# Altium schematic sheet lvds.SchDoc
size Legal
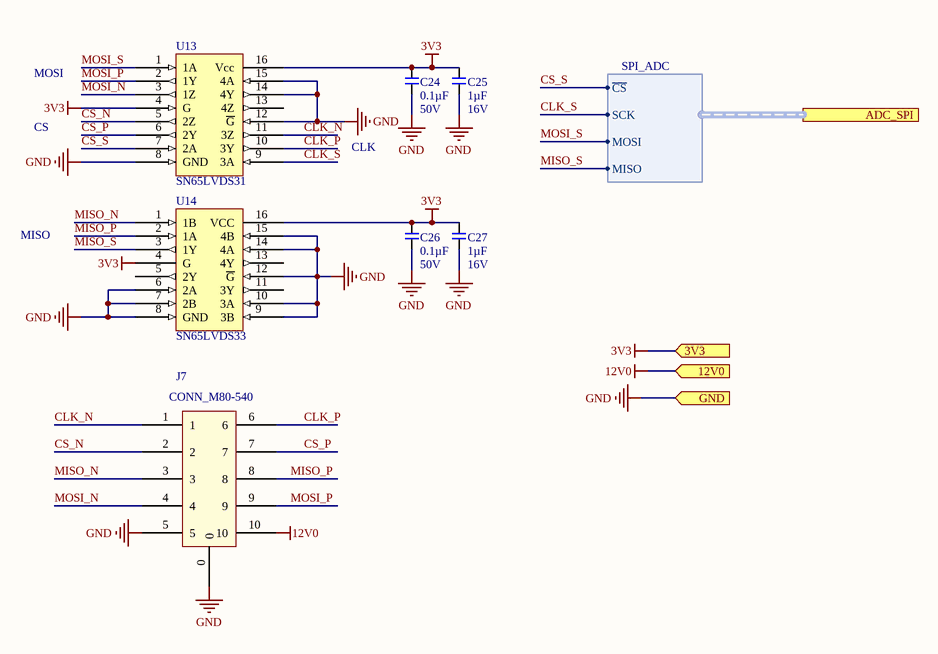
[diagram p0: lvds.SchDoc]

## Parts
C24  Capacitance (shorthand): 0.1µF  Rated Voltage: 50V  [C0603P]  (hidden comment: __template_cap)
C25  Capacitance (shorthand): 1µF  Rated Voltage: 16V  [C0603P]  (hidden comment: __template_cap)
C26  Capacitance (shorthand): 0.1µF  Rated Voltage: 50V  [C0603P]  (hidden comment: __template_cap)
C27  Capacitance (shorthand): 1µF  Rated Voltage: 16V  [C0603P]  (hidden comment: __template_cap)
J7  CONN_M80-540  [HARWIN-M80-5401042]
U13  SN65LVDS31  [16SOIC150]
U14  SN65LVDS33  [16SOIC150]

## Ports
3V3 (in), 12V0 (in), ADC_SPI (harness SPI_ADC), GND (in)

## Harnesses
SPI_ADC: SCK, MOSI, MISO, ~{CS}

## Nets
3V3: C24.1 C25.1 C26.1 C27.1 U13.4(G) U13.16(Vcc) U14.4(G) U14.16(VCC) ; port 3V3
12V0: J7.10 ; port 12V0
GND: C24.2 C25.2 C26.2 C27.2 J7.0 J7.5 U13.8(GND) U13.12(~{G}) U13.14(4Y) U13.15(4A) U14.6(2A) U14.7(2B) U14.8(GND) U14.9(3B) U14.10(3A) U14.12(~{G}) U14.14(4A) U14.15(4B) ; port GND
CLK_N: J7.1 U13.11(3Z)
CLK_P: J7.6 U13.10(3Y)
CLK_S: U13.9(3A) ; port ADC_SPI.SCK
CS_N: J7.2 U13.5(2Z)
CS_P: J7.7 U13.6(2Y)
CS_S: U13.7(2A) ; port ADC_SPI.~{CS}
MISO_N: J7.3 U14.1(1B)
MISO_P: J7.8 U14.2(1A)
MISO_S: U14.3(1Y) ; port ADC_SPI.MISO
MOSI_N: J7.4 U13.3(1Z)
MOSI_P: J7.9 U13.2(1Y)
MOSI_S: U13.1(1A) ; port ADC_SPI.MOSI

Not connected (* = marked no-connect by the designer): U13 13(4Z); U14 5(2Y) 11(3Y) 13(4Y)

## Notes on the sheet
- MOSI
- CS
- CLK
- MISO
- PROJECT
- SHEET
- Powered By
- Sheet
- of
- REVISION
- ssi.stanford.edu
- ENGINEER
- REVIEWER
- REVIEWED ON

## Library data of the parts
C24 C26 = 490-1519-1-ND: CAP CER 0603 0.1µF X7R 50V 10%; Manufacturer: Murata Electronics North America; Capacitance - pF (Machine readable): #NAME?; type: capacitor; Supplier Part Number 1: 490-1519-1-ND; Dielectric: X7R; Supplier 1: Digikey
C25 C27 = 490-3900-1-ND: CAP CER 0603 1µF X7R 16V 10%; Manufacturer: Murata Electronics North America; Capacitance - pF (Machine readable): #NAME?; type: capacitor; Supplier Part Number 1: 490-3900-1-ND; Dielectric: X7R; Supplier 1: Digikey
U13 = SN65LVDS31: SPI TO LVDS FOR DIFF TRANSMISSION
U14 = SN65LVDS33: LVDS TO SPI RECEIVER